# EAGLE design led_board_v2 (EAGLE 7.5.0)
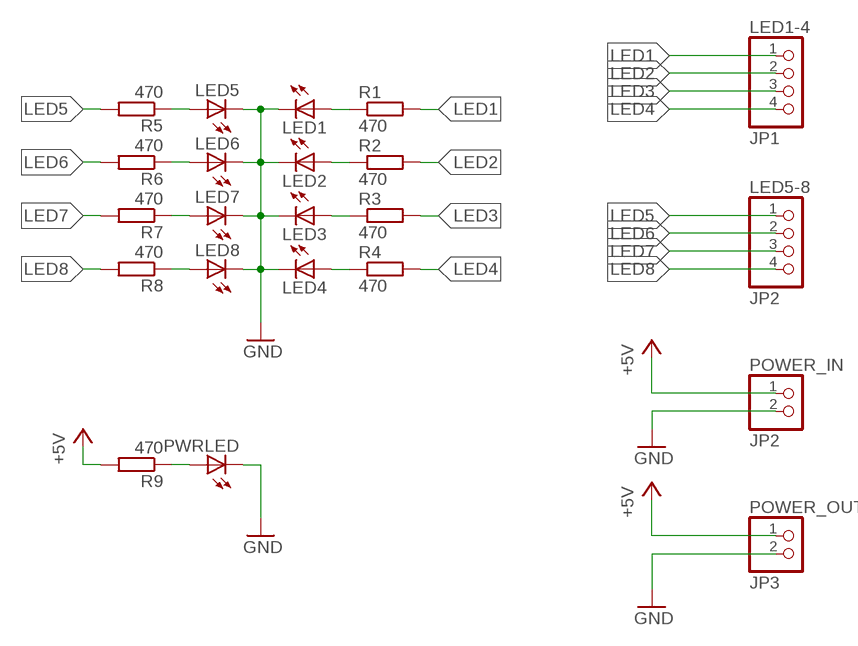
[diagram p0: schematic, sheet 1]

## Parts
LED1  LED3MM  [LED3MM]
LED1-4  JP1  PINHD-1X4  [1X04]
LED2  LED3MM  [LED3MM]
LED3  LED3MM  [LED3MM]
LED4  LED3MM  [LED3MM]
LED5  LED3MM  [LED3MM]
LED5-8  JP2  PINHD-1X4  [1X04]
LED6  LED3MM  [LED3MM]
LED7  LED3MM  [LED3MM]
LED8  LED3MM  [LED3MM]
POWER_IN  JP2  PINHD-1X2  [1X02]
POWER_OUT  JP3  PINHD-1X2  [1X02]
PWRLED  LED3MM  [LED3MM]
R1  470  R-EU_R0805  [R0805]
R2  470  R-EU_R0805  [R0805]
R3  470  R-EU_R0805  [R0805]
R4  470  R-EU_R0805  [R0805]
R5  470  R-EU_R0805  [R0805]
R6  470  R-EU_R0805  [R0805]
R7  470  R-EU_R0805  [R0805]
R8  470  R-EU_R0805  [R0805]
R9  470  R-EU_R0805  [R0805]

## Nets
+5V: POWER_IN.1 POWER_OUT.1 R9.2
GND: LED1.K(C) LED2.K(C) LED3.K(C) LED4.K(C) LED5.K(C) LED6.K(C) LED7.K(C) LED8.K(C) POWER_IN.2 POWER_OUT.2 PWRLED.K(C)
LED1: LED1-4.1 R1.2
LED2: LED1-4.2 R2.2
LED3: LED1-4.3 R3.2
LED4: LED1-4.4 R4.2
LED5: LED5-8.1 R5.2
LED6: LED5-8.2 R6.2
LED7: LED5-8.3 R7.2
LED8: LED5-8.4 R8.2
N$1: LED1.A R1.1
N$2: LED2.A R2.1
N$3: LED3.A R3.1
N$4: LED4.A R4.1
N$5: LED5.A R5.1
N$6: LED6.A R6.1
N$7: LED7.A R7.1
N$8: LED8.A R8.1
N$9: PWRLED.A R9.1

## Library data of the parts
LED1-LED8 PWRLED = led:LED: LED OSRAM: - CHIPLED LG R971, LG N971, LY N971, LG Q971, LY Q971, LO R971, LY R971 LH N974, LH R974 LS Q976, LO Q976, LY Q976 LO Q996 - Hyper CHIPLED LW Q18S LB Q993, LB Q99A, LB R99A - SideLED LS A670, LO A670, LY A670, LG A670, LP A670 LB A673, LV A673, LT A673, LW A673 LH A674 LY A675 LS A676, LA A676, LO A676, LY A676, LW A676 LS A679, LY A679, LG A679 - Hyper Micro SIDELED® LS Y876, LA Y876, LO Y876, LY Y876 LT Y87S - SmartLED LW L88C, LW L88S LB L89C, LB L89S, LG L890 LS L89K, LO L89K, LY L89K LS L896, LA L896, LO L896, LY L896 - TOPLED LS T670, LO T670, LY T670, LG T670, LP T670 LSG T670, LSP T670, LSY T670, LOP T670, LYG T670 LG T671, LOG T671, LSG T671 LB T673, LV T673, LT T673, LW T673 LH T674 LS T676, LA T676, LO T676, LY T676, LB T676, LH T676, LSB T676, LW T676 LB T67C, LV T67C, LT T67C, LS T67K, LO T67K, LY T67K, LW E67C LS E67B, LA E67B, LO E67B, LY E67B, LB E67C, LV E67C, LT E67C LW T67C LS T679, LY T679, LG T679 LS T770, LO T770, LY T770, LG T770, LP T770 LB T773, LV T773, LT T773, LW T773 LH T774 LS E675, LA E675, LY E675, LS T675 LS T776, LA T776, LO T776, LY T776, LB T776 LHGB T686 LT T68C, LB T68C - Hyper Mini TOPLED® LB M676 - Mini TOPLED Santana® LG M470 LS M47K, LO M47K, LY M47K Source: http://www.osram.convergy.de LUXEON: - LUMILED® LXK2-PW12-R00, LXK2-PW12-S00, LXK2-PW14-U00, LXK2-PW14-V00 LXK2-PM12-R00, LXK2-PM12-S00, LXK2-PM14-U00 LXK2-PE12-Q00, LXK2-PE12-R00, LXK2-PE12-S00, LXK2-PE14-T00, LXK2-PE14-U00 LXK2-PB12-K00, LXK2-PB12-L00, LXK2-PB12-M00, LXK2-PB14-N00, LXK2-PB14-P00, LXK2-PB14-Q00 LXK2-PR12-L00, LXK2-PR12-M00, LXK2-PR14-Q00, LXK2-PR14-R00 LXK2-PD12-Q00, LXK2-PD12-R00, LXK2-PD12-S00 LXK2-PH12-R00, LXK2-PH12-S00 LXK2-PL12-P00, LXK2-PL12-Q00, LXK2-PL12-R00 Source: www.luxeon.com KINGBRIGHT: KA-3528ASYC Source: www.kingbright.com
LED1-4 LED5-8 = pinhead:PINHD-1X4: PIN HEADER
POWER_IN POWER_OUT = pinhead:PINHD-1X2: PIN HEADER
R1-R9 = resistor:R-EU_: RESISTOR, European symbol

## Board
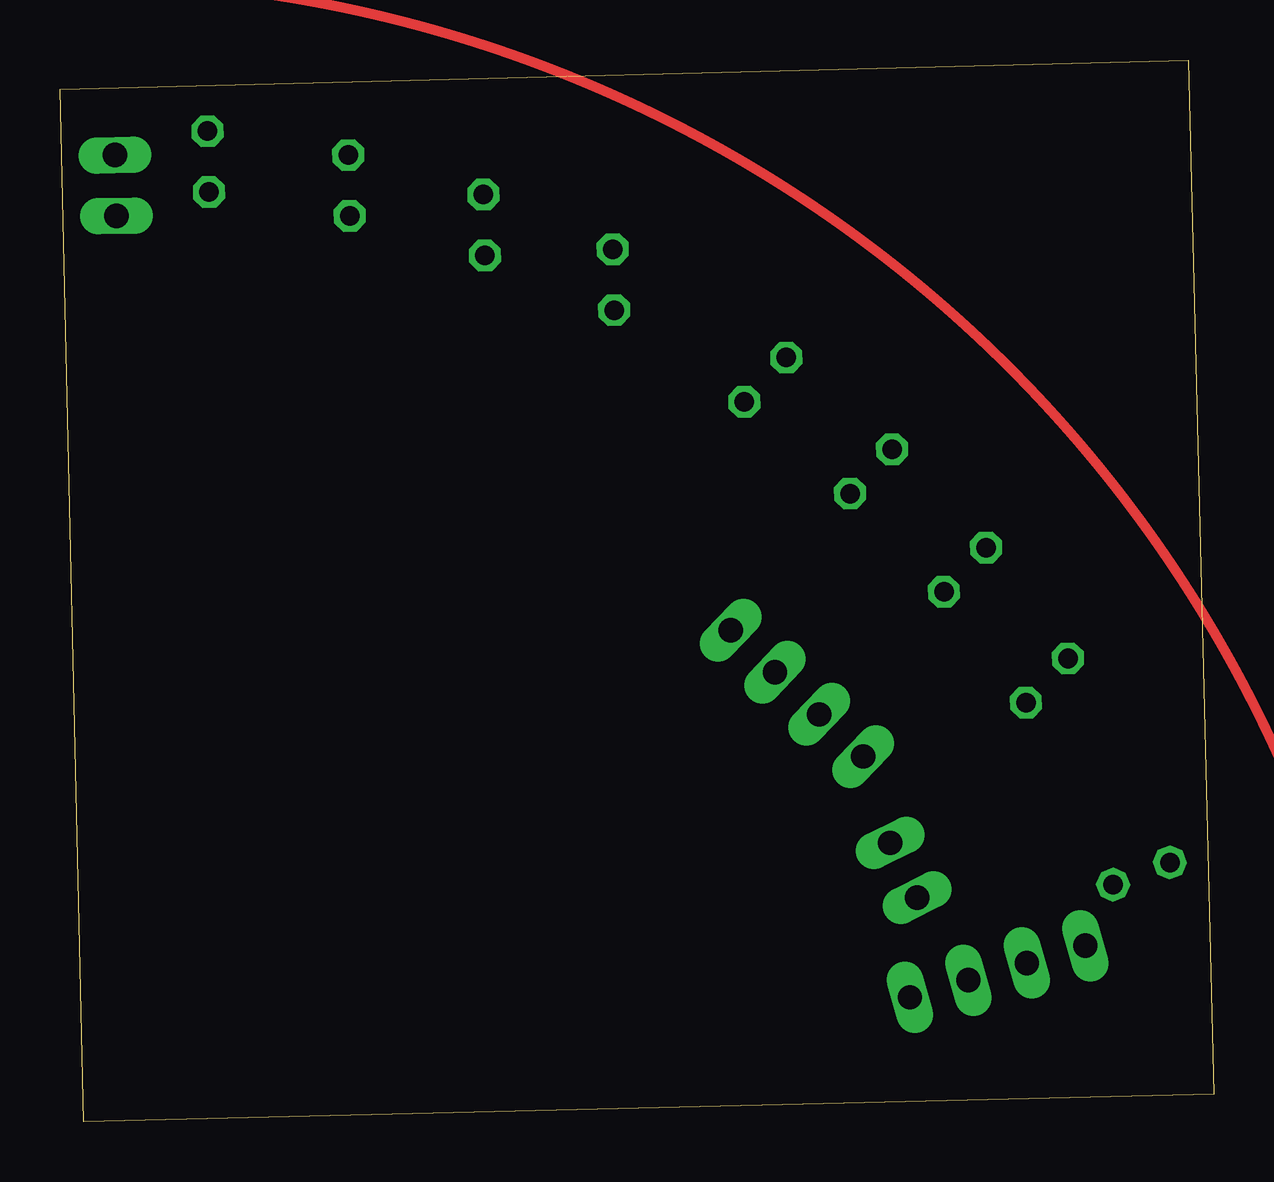
[diagram p1: board, top side]
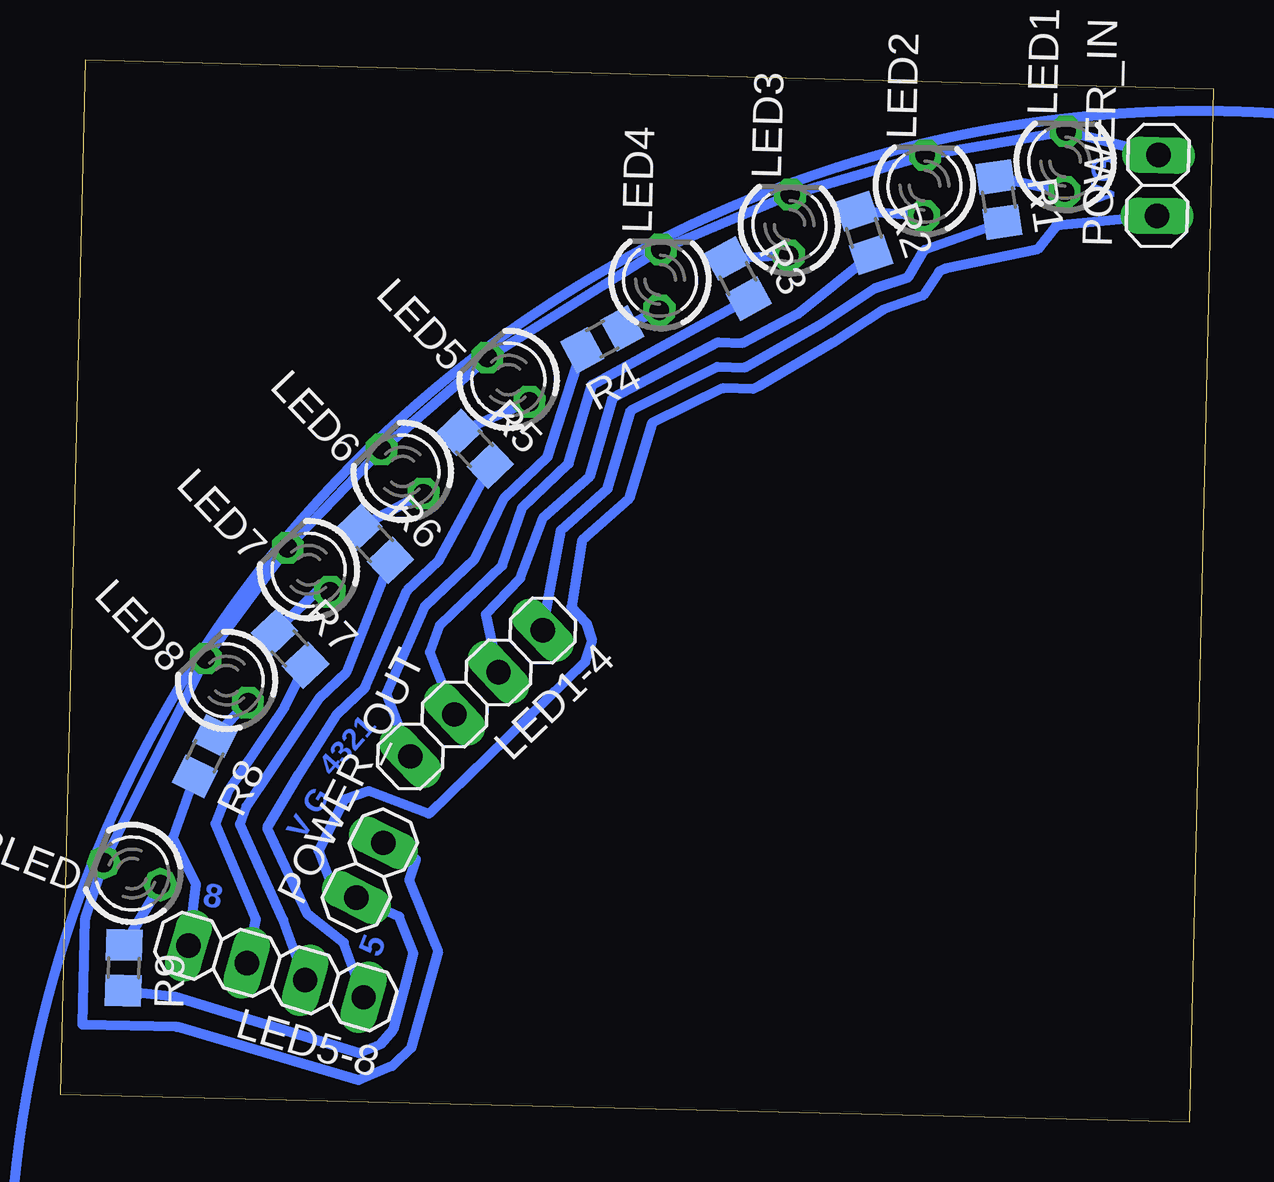
[diagram p2: board, bottom side, seen from below]

Size 48.09 x 44.26 mm. Coordinates in mm from the lower left corner, seen from the top.
Outline: 1,0 0,43.04 47.03,44.26 48.09,1.15 1,0
Copper layers (1*16): Top 0.035mm / dielectric 1.5mm / Bottom 0.035mm
Design rules "default *": minimum track width 10mil, minimum drill 24mil, track to track 8mil, track to pad 8mil, pad to pad 8mil, via to via 8mil, smd to smd 8mil, copper to edge 25mil, drill to drill 8mil, minimum pad ring 10mil, minimum via ring 8mil, stop-mask expansion 4mil, vias tented up to drill 0mil, thermal gap 10mil

### Footprints (pad centres in the part's own frame; a part is rotated, then mirrored left to right if it is on the bottom)
LED3MM = drill 0.813 octagon: A -1.27,0; K 1.27,0
1X04 = drill 1.016 long: 1 -3.81,0; 2 -1.27,0; 3 1.27,0; 4 3.81,0
1X02 = drill 1.016 long: 1 -1.27,0; 2 1.27,0
R0805 = smd 1.3 x 1.5: 1 -0.95,0; 2 0.95,0

### Placement (x,y rotation side)
LED1  6.18,40.03 88.6 bottom
LED1-4  30.72,17.86 223.6 bottom
LED2  12.05,39.03 88.6 bottom
LED3  17.68,37.39 88.6 bottom
LED4  23.07,35.1 88.6 bottom
LED5  29.4,30.94 133.6 bottom
LED5-8  39.08,6.27 163.6 bottom
LED6  33.81,27.11 133.6 bottom
LED7  37.72,23.01 133.6 bottom
LED8  41.14,18.4 133.6 bottom
POWER_IN  2.33,39.03 88.6 bottom
POWER_OUT  35.17,10.49 63.6 bottom
PWRLED  45.08,10.35 158.6 bottom
R1  8.95,38.44 278.6 bottom
R2  14.58,37.06 288.6 bottom
R3  19.83,35.15 298.6 bottom
R4  25.48,32.62 208.6 bottom
R5  30.8,28.05 313.6 bottom
R6  34.96,24.09 313.6 bottom
R7  38.5,19.73 313.6 bottom
R8  42.04,15.24 243.6 bottom
R9  45.43,6.42 268.6 bottom

### Tracks (layer width: path | path; a pad name or v marks a point on that pad's centre or on a via)
+5V
  Bottom 0.406: POWER_IN.1 6.56,37.36 7.35,36.36 11.18,35.57 11.44,35.44 12.1,34.44 13.76,33.85 15.83,32.5 18.92,30.67 19.18,30.55 20.45,30.58 23.41,29.13 24.37,25.98 26.32,24.25 26.77,21.46 26.15,20.81 25.92,20.05 26.2,19.16 32.7,12.84 35.22,13.79 36.24,13.44 37.31,11.3 36.83,10.02 POWER_OUT.1 33.95,8.55 33.35,7.02 33.63,5.88 34.19,3.86 34.71,3.24 35.61,2.88 43.3,5.23 R9.2
GND
  Bottom 0.406: POWER_IN.2 LED1.K LED2.K LED3.K LED4.K LED5.K LED6.K LED7.K LED8.K PWRLED.K 47.03,8.49 47.14,4.05 43.2,3.95 35.64,1.74 34.22,2.34 33.44,3.08 32.33,7.12 33.53,10.07 33.25,10.95 POWER_OUT.2
LED1
  Bottom 0.406: LED1-4.1 27.2,24.65 25.25,26.38 24.28,29.66 20.68,31.48 19.54,31.45 16.32,33.28 14.12,34.75 12.71,35.22 12.05,36.35 R1.2
LED2
  Bottom 0.406: LED1-4.2 30.33,21.17 28.9,22.66 27.95,25.18 26,26.91 25.03,30.19 20.66,32.49 19.64,32.47 17.32,33.68 R2.2
LED3
  Bottom 0.406: LED1-4.3 32.66,19.58 32.25,20.71 29.65,23.19 28.83,25.58 26.88,27.44 25.91,30.72 R3.2
LED4
  Bottom 0.406: LED1-4.4 34.48,17.84 32.87,21.49 30.79,23.47 29.58,25.98 27.76,27.71 R4.2
LED5
  Bottom 0.406: R5.2 32.31,23.38 33.61,22.14 35.36,18.12 36.53,17 38.12,14.5 39.45,12.25 37.75,8.65 36.26,7.47 LED5-8.1
LED6
  Bottom 0.406: R6.2 36.15,18.73 37.28,17.66 40.31,13.16 40.58,12.4 38.78,8.42 LED5-8.2
LED7
  Bottom 0.406: R7.2 38.72,17.27 41.06,13.81 41.6,12.43 39.92,8.45 LED5-8.3
LED8
  Bottom 0.406: R8.2 43.39,11.83 42.42,9.91 LED5-8.4
N$1
  Bottom 0.406: LED1.A R1.1
N$2
  Bottom 0.406: LED2.A R2.1
N$3
  Bottom 0.406: LED3.A R3.1
N$4
  Bottom 0.406: LED4.A R4.1
N$5
  Bottom 0.406: LED5.A R5.1
N$6
  Bottom 0.406: LED6.A R6.1
N$7
  Bottom 0.406: LED7.A 37.38,22.11 R7.1
N$8
  Bottom 0.406: R8.1 40.69,17.07 LED8.A
N$9
  Bottom 0.406: PWRLED.A R9.1
(copper drawn outside any net)
  shapes: Bottom circle x1, Top circle x1

### Text on the board
Bottom: VG | 4321 | V G | 8 | 5